# Altium project Cleanroom PSM.PrjPcb
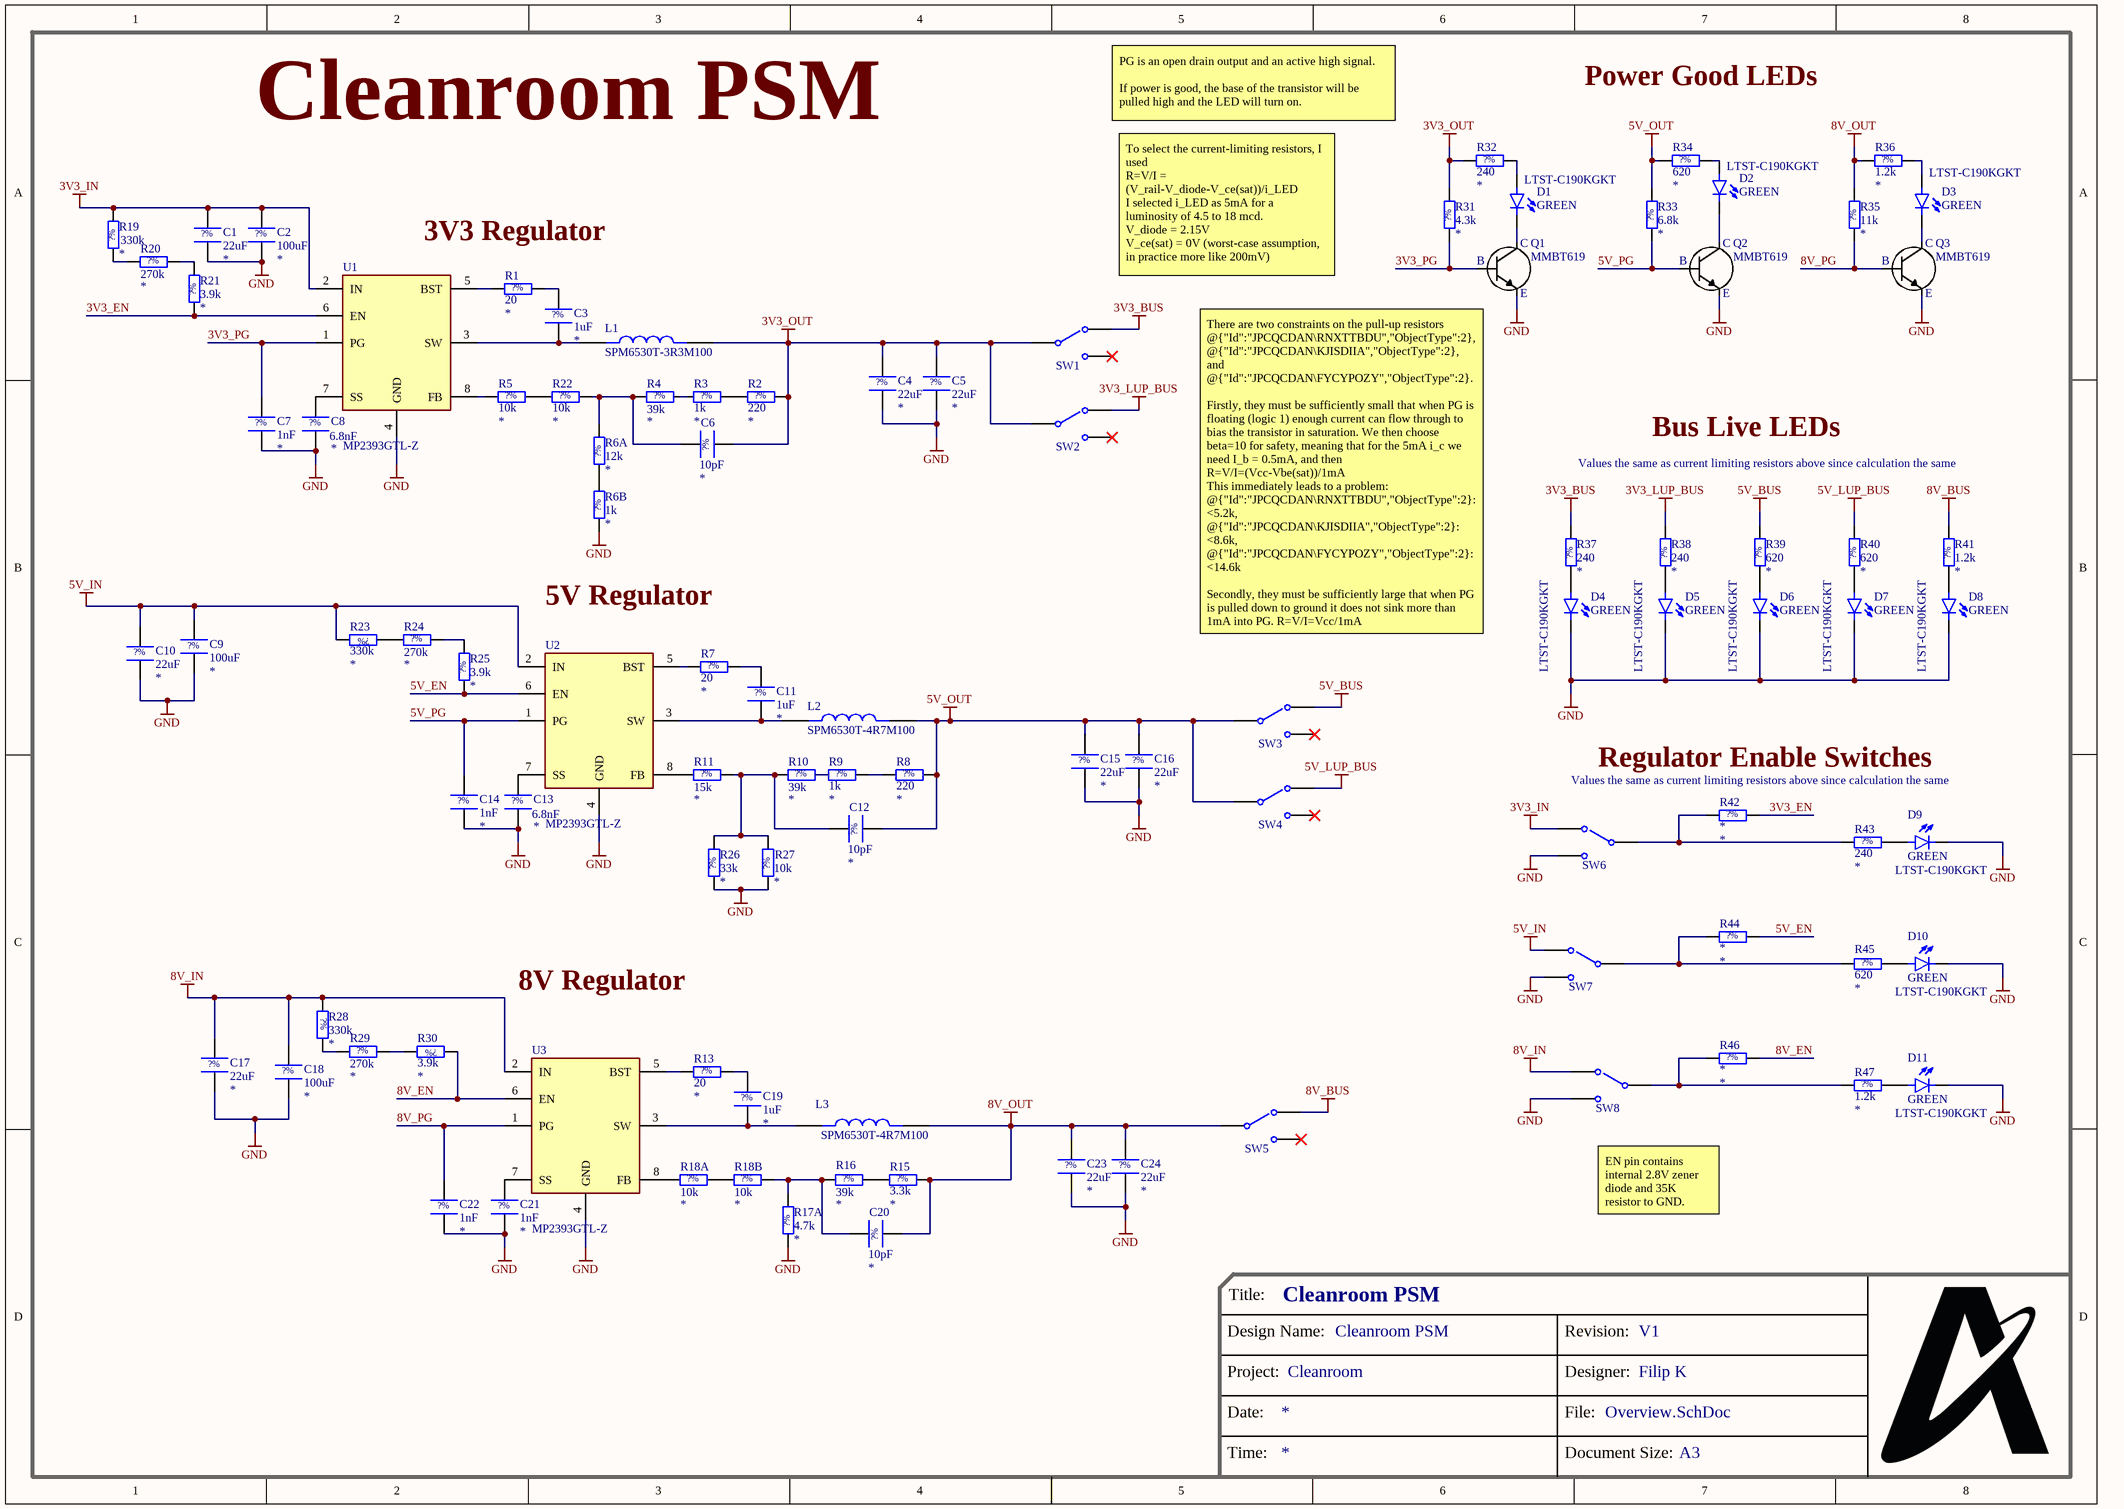
[diagram p0: Overview.SchDoc]
BoardRevision: V1; Designer: Filip K; DesignName: Cleanroom PSM; Project: Cleanroom
1 sheet, 99 parts. Net scope: global (net labels, ports and power ports of the same name join across sheets).
Board file: Overview.PcbDoc

## Sheet Overview.SchDoc: Cleanroom PSM
size A3; PageSetup: Record=PageOptions|CenterHorizontal=True|CenterVertical=True|PrintScale=0.97|XCorrection=1.00|YCorrection=1.00|PrintKind=0|BorderSize=5000000|LeftOffset=0|BottomOffset=0|Orientation=2|PaperLength=1000|PaperWidth=1000|Scale=100|PaperSource=7|PrintQuality=-4|MediaType=1|DitherType=10|PaperKind=A4|PrintScaleMode=1; SheetNumber: 1; SheetTotal: 1

### Parts
C1  22uF  [CAPACITOR_0805_2012M-70N]
C2  100uF  [CAPACITOR_0805_2012M-70N]
C3  1uF  [CAPACITOR_0805_2012M-70N]
C4  22uF  [CAPACITOR_0805_2012M-70N]
C5  22uF  [CAPACITOR_0805_2012M-70N]
C6  10pF  [CAPACITOR_0805_2012M-70N]
C7  1nF  [CAPACITOR_0805_2012M-70N]
C8  6.8nF  [CAPACITOR_0805_2012M-70N]
C9  100uF  [CAPACITOR_0805_2012M-70N]
C10  22uF  [CAPACITOR_0805_2012M-70N]
C11  1uF  [CAPACITOR_0805_2012M-70N]
C12  10pF  [CAPACITOR_0805_2012M-70N]
C13  6.8nF  [CAPACITOR_0805_2012M-70N]
C14  1nF  [CAPACITOR_0805_2012M-70N]
C15  22uF  [CAPACITOR_0805_2012M-70N]
C16  22uF  [CAPACITOR_0805_2012M-70N]
C17  22uF  [CAPACITOR_0805_2012M-70N]
C18  100uF  [CAPACITOR_0805_2012M-70N]
C19  1uF  [CAPACITOR_0805_2012M-70N]
C20  10pF  [CAPACITOR_0805_2012M-70N]
C21  1nF  [CAPACITOR_0805_2012M-70N]
C22  1nF  [CAPACITOR_0805_2012M-70N]
C23  22uF  [CAPACITOR_0805_2012M-70N]
C24  22uF  [CAPACITOR_0805_2012M-70N]
D1  MF Part No.: LTST-C190KGKT  Colour: GREEN  [LED_0603_1608M_0.80mm]  (hidden comment: LTST-C190 Series)
D2  MF Part No.: LTST-C190KGKT  Colour: GREEN  [LED_0603_1608M_0.80mm]  (hidden comment: LTST-C190 Series)
D3  MF Part No.: LTST-C190KGKT  Colour: GREEN  [LED_0603_1608M_0.80mm]  (hidden comment: LTST-C190 Series)
D4  MF Part No.: LTST-C190KGKT  Colour: GREEN  [LED_0603_1608M_0.80mm]  (hidden comment: LTST-C190 Series)
D5  MF Part No.: LTST-C190KGKT  Colour: GREEN  [LED_0603_1608M_0.80mm]  (hidden comment: LTST-C190 Series)
D6  MF Part No.: LTST-C190KGKT  Colour: GREEN  [LED_0603_1608M_0.80mm]  (hidden comment: LTST-C190 Series)
D7  MF Part No.: LTST-C190KGKT  Colour: GREEN  [LED_0603_1608M_0.80mm]  (hidden comment: LTST-C190 Series)
D8  MF Part No.: LTST-C190KGKT  Colour: GREEN  [LED_0603_1608M_0.80mm]  (hidden comment: LTST-C190 Series)
D9  MF Part No.: LTST-C190KGKT  Colour: GREEN  [LED_0603_1608M_0.80mm]  (hidden comment: LTST-C190 Series)
D10  MF Part No.: LTST-C190KGKT  Colour: GREEN  [LED_0603_1608M_0.80mm]  (hidden comment: LTST-C190 Series)
D11  MF Part No.: LTST-C190KGKT  Colour: GREEN  [LED_0603_1608M_0.80mm]  (hidden comment: LTST-C190 Series)
L1  SPM6530T-3R3M100  [IND_SPM6530T-1R5M100]
L2  SPM6530T-4R7M100  [IND_SPM6530T-1R5M100]
L3  SPM6530T-4R7M100  [IND_SPM6530T-1R5M100]
Q1  MMBT619  [SOT23-3N-1.15mm]
Q2  MMBT619  [SOT23-3N-1.15mm]
Q3  MMBT619  [SOT23-3N-1.15mm]
R1  20  [RESISTOR_0805_2012M-50N]
R2  220  [RESISTOR_0805_2012M-50N]
R3  1k  [RESISTOR_0805_2012M-50N]
R4  39k  [RESISTOR_0805_2012M-50N]
R5  10k  [RESISTOR_0805_2012M-50N]
R6A  12k  [RESISTOR_0805_2012M-50N]
R6B  1k  [RESISTOR_0805_2012M-50N]
R7  20  [RESISTOR_0805_2012M-50N]
R8  220  [RESISTOR_0805_2012M-50N]
R9  1k  [RESISTOR_0805_2012M-50N]
R10  39k  [RESISTOR_0805_2012M-50N]
R11  15k  [RESISTOR_0805_2012M-50N]
R13  20  [RESISTOR_0805_2012M-50N]
R15  3.3k  [RESISTOR_0805_2012M-50N]
R16  39k  [RESISTOR_0805_2012M-50N]
R17A  4.7k  [RESISTOR_0805_2012M-50N]
R18A  10k  [RESISTOR_0805_2012M-50N]
R18B  10k  [RESISTOR_0805_2012M-50N]
R19  330k  [RESISTOR_0805_2012M-50N]
R20  270k  [RESISTOR_0805_2012M-50N]
R21  3.9k  [RESISTOR_0805_2012M-50N]
R22  10k  [RESISTOR_0805_2012M-50N]
R23  330k  [RESISTOR_0805_2012M-50N]
R24  270k  [RESISTOR_0805_2012M-50N]
R25  3.9k  [RESISTOR_0805_2012M-50N]
R26  33k  [RESISTOR_0805_2012M-50N]
R27  10k  [RESISTOR_0805_2012M-50N]
R28  330k  [RESISTOR_0805_2012M-50N]
R29  270k  [RESISTOR_0805_2012M-50N]
R30  3.9k  [RESISTOR_0805_2012M-50N]
R31  4.3k  [RESISTOR_0805_2012M-50N]
R32  240  [RESISTOR_0805_2012M-50N]
R33  6.8k  [RESISTOR_0805_2012M-50N]
R34  620  [RESISTOR_0805_2012M-50N]
R35  11k  [RESISTOR_0805_2012M-50N]
R36  1.2k  [RESISTOR_0805_2012M-50N]
R37  240  [RESISTOR_0805_2012M-50N]
R38  240  [RESISTOR_0805_2012M-50N]
R39  620  [RESISTOR_0805_2012M-50N]
R40  620  [RESISTOR_0805_2012M-50N]
R41  1.2k  [RESISTOR_0805_2012M-50N]
R42  *  [RESISTOR_0805_2012M-50N]
R43  240  [RESISTOR_0805_2012M-50N]
R44  *  [RESISTOR_0805_2012M-50N]
R45  620  [RESISTOR_0805_2012M-50N]
R46  *  [RESISTOR_0805_2012M-50N]
R47  1.2k  [RESISTOR_0805_2012M-50N]
SW1  ANT11SF1CQE  [ANT11SF1CQE]  (value not drawn)
SW2  ANT11SF1CQE  [ANT11SF1CQE]  (value not drawn)
SW3  ANT11SF1CQE  [ANT11SF1CQE]  (value not drawn)
SW4  ANT11SF1CQE  [ANT11SF1CQE]  (value not drawn)
SW5  ANT11SF1CQE  [ANT11SF1CQE]  (value not drawn)
SW6  ANT11SF1CQE  [ANT11SF1CQE]  (value not drawn)
SW7  ANT11SF1CQE  [ANT11SF1CQE]  (value not drawn)
SW8  ANT11SF1CQE  [ANT11SF1CQE]  (value not drawn)
U1  MP2393GTL-Z  [SOT-583-2.1mmx1.6mmBody-0.6mm]
U2  MP2393GTL-Z  [SOT-583-2.1mmx1.6mmBody-0.6mm]
U3  MP2393GTL-Z  [SOT-583-2.1mmx1.6mmBody-0.6mm]

### Nets
3V3_BUS: R37.2 SW1.1
3V3_IN: C1.2 C2.2 R19.2 SW6.1 U1.2(IN)
3V3_LUP_BUS: R38.2 SW2.1
3V3_OUT: C4.2 C5.2 C6.1 L1.2 R2.2 R31.2 R32.1 SW1.2 SW2.2
5V_BUS: R39.2 SW3.1
5V_IN: C9.2 C10.2 R23.2 SW7.1 U2.2(IN)
5V_LUP_BUS: R40.2 SW4.1
5V_OUT: C12.1 C15.2 C16.2 L2.2 R8.2 R33.2 R34.1 SW3.2 SW4.2
8V_BUS: R41.2 SW5.1
8V_IN: C17.2 C18.2 R28.1 SW8.1 U3.2(IN)
8V_OUT: C20.1 C23.2 C24.2 L3.2 R15.2 R35.2 R36.1 SW5.2
GND: C1.1 C2.1 C4.1 C5.1 C7.1 C8.1 C9.1 C10.1 C13.1 C14.1 C15.1 C16.1 C17.1 C18.1 C21.1 C22.1 C23.1 C24.1 D4.C D5.C D6.C D7.C D8.C D9.C D10.C D11.C Q1.2(E) Q2.2(E) Q3.2(E) R6B.1 R17A.1 R26.1 R27.1 SW6.3 SW7.3 SW8.3 U1.4(GND) U2.4(GND) U3.4(GND)
3V3_EN: R21.1 R42.2 U1.6(EN)
3V3_PG: C7.2 Q1.1(B) R31.1 U1.1(PG)
5V_EN: R25.1 R44.2 U2.6(EN)
5V_PG: C14.2 Q2.1(B) R33.1 U2.1(PG)
8V_EN: R30.1 R46.2 U3.6(EN)
8V_PG: C22.2 Q3.1(B) R35.1 U3.1(PG)
NetC3_1: C3.1 L1.1 U1.3(SW)
NetC3_2: C3.2 R1.2
NetC6_2: C6.2 R4.1 R6A.2 R22.2
NetC8_2: C8.2 U1.7(SS)
NetC11_1: C11.1 L2.1 U2.3(SW)
NetC11_2: C11.2 R7.2
NetC12_2: C12.2 R10.1 R11.2 R26.2 R27.2
NetC13_2: C13.2 U2.7(SS)
NetC19_1: C19.1 L3.1 U3.3(SW)
NetC19_2: C19.2 R13.2
NetC20_2: C20.2 R16.1 R17A.2 R18B.2
NetC21_2: C21.2 U3.7(SS)
NetD1_A: D1.A R32.2
NetD1_C: D1.C Q1.3(C)
NetD2_A: D2.A R34.2
NetD2_C: D2.C Q2.3(C)
NetD3_A: D3.A R36.2
NetD3_C: D3.C Q3.3(C)
NetD4_A: D4.A R37.1
NetD5_A: D5.A R38.1
NetD6_A: D6.A R39.1
NetD7_A: D7.A R40.1
NetD8_A: D8.A R41.1
NetD9_A: D9.A R43.2
NetD10_A: D10.A R45.2
NetD11_A: D11.A R47.2
NetR1_1: R1.1 U1.5(BST)
NetR2_1: R2.1 R3.2
NetR3_1: R3.1 R4.2
NetR5_1: R5.1 U1.8(FB)
NetR5_2: R5.2 R22.1
NetR6A_1: R6A.1 R6B.2
NetR7_1: R7.1 U2.5(BST)
NetR8_1: R8.1 R9.2
NetR9_1: R9.1 R10.2
NetR11_1: R11.1 U2.8(FB)
NetR13_1: R13.1 U3.5(BST)
NetR15_1: R15.1 R16.2
NetR18A_1: R18A.1 U3.8(FB)
NetR18A_2: R18A.2 R18B.1
NetR19_1: R19.1 R20.1
NetR20_2: R20.2 R21.2
NetR23_1: R23.1 R24.1
NetR24_2: R24.2 R25.2
NetR28_2: R28.2 R29.1
NetR29_2: R29.2 R30.2
NetR42_1: R42.1 R43.1 SW6.2
NetR44_1: R44.1 R45.1 SW7.2
NetR46_1: R46.1 R47.1 SW8.2

Not connected (* = marked no-connect by the designer): SW1 3*; SW2 3*; SW3 3*; SW4 3*; SW5 3*

### Notes on the sheet
- Power Good LEDs
- Cleanroom PSM
- PG is an open drain output and an active high signal.
  If power is good, the base of the transistor will be pulled high and the LED will turn on.
- 3V3 Regulator
- To select the current-limiting resistors, I used
  R=V/I = (V_rail-V_diode-V_ce(sat))/i_LED
  I selected i_LED as 5mA for a luminosity of 4.5 to 18 mcd.
  V_diode = 2.15V
  V_ce(sat) = 0V (worst-case assumption, in practice more like 200mV)
- Bus Live LEDs
- Values the same as current limiting resistors above since calculation the same
- 5V Regulator
- (near Q1) There are two constraints on the pull-up resistors @{"Id":"JPCQCDAN\RNXTTBDU","ObjectType":2}, @{"Id":"JPCQCDAN\KJISDIIA","ObjectType":2}, and @{"Id":"JPCQCDAN\FYCYPOZY","ObjectType":2}.
  Firstly, they must be sufficiently small that when PG is floating (logic 1) enough current can flow through to bias the transistor in saturation. We then choose beta=10 for safety, meaning that for the 5mA i_c we need I_b = 0.5mA, and then R=V/I=(Vcc-Vbe(sat))/1mA
  This immediately leads to a problem:
  @{"Id":"JPCQCDAN\RNXTTBDU","ObjectType":2}: <5.2k, @{"Id":"JPCQCDAN\KJISDIIA","ObjectType":2}: <8.6k, @{"Id":"JPCQCDAN\FYCYPOZY","ObjectType":2}: <14.6k
  Secondly, they must be sufficiently large that when PG is pulled down to ground it does not sink more than 1mA into PG. R=V/I=Vcc/1mA
  @{"Id":"JPCQCDAN\RNXTTBDU","ObjectType":2}: >3.3k, @{"Id":"JPCQCDAN\KJISDIIA","ObjectType":2}: >5k, @{"Id":"JPCQCDAN\FYCYPOZY","ObjectType":2}: >8k
  Taking the mean of each of these ranges and rounding to the nearest E24,
  @{"Id":"JPCQCDAN\RNXTTBDU","ObjectType":2}: 4.3k, @{"Id":"JPCQCDAN\KJISDIIA","ObjectType":2}: 6.8k, @{"Id":"JPCQCDAN\FYCYPOZY","ObjectType":2}: 11k
- Regulator Enable Switches
- 8V Regulator
- (near SW8) EN pin contains internal 2.8V zener diode and 35K resistor to GND.
- Title:
- Design Name:
- Project:
- Revision:
- Designer:
- Date:
- Time:
- File:
- Document Size:
- A3

### Library data of the parts
C1-C24 = Generic Capacitor: Passive - Capacitor, Generic; Tolerance: ?%; MF Part No.: *
  C1 C4 C5 C10 C15-C17 C23 C24: Value: 22uF
  C2 C9 C18: Value: 100uF
  C3 C11 C19: Value: 1uF
  C6 C12 C20: Value: 10pF
  C7 C14 C21 C22: Value: 1nF
  C8 C13: Value: 6.8nF
D1-D11 = LTST-C190 Series: Diode - LED, 0603; APSS Standard Part: APSS Standard; Temp Range: -30°C ~ 85°C; Rated Voltage: 5V Reverse; Package: 0603; Supplier 1: Digikey
L1-L3 = SPM6530T-1R5M100: 1.5 ÂµH Shielded Drum Core, Wirewound Inductor 11 A 10.67mOhm Max Nonstandard; MF: TDK; Value: *; Digi-Key_Part_Number: 445-3881-2-ND; Check_prices: https://www.snapeda.com/parts/SPM6530T-1R5M100/TDK/view-part/?ref=eda; Package: NON STANDARD-2 TDK; SnapEDA_Link: https://www.snapeda.com/parts/SPM6530T-1R5M100/TDK/view-part/?ref=snap; MP: SPM6530T-1R5M100; Purchase-URL: https://pricing.snapeda.com/search/part/SPM6530T-1R5M100/?ref=eda
Q1-Q3 = MMBT619: Transistor - BJT NPN MMBT619; APSS Standard Part: APSS Standard; Temp Range: -55°C ~ 150°C (TJ); Rated Voltage: 50 Vce; Power: 350mW; MF Part No.: MMBT619; Package: SOT-23-3; Supplier 1: Digikey; Supplier 1 Part No.: 4786-MMBT619CT-ND
R1-R5 R6A R6B R7-R11 R13 R15 R16 R17A R18A R18B R19-R47 = Generic Resistor: Passive - Resistor, Generic; Tolerance: ?%; MF Part No.: *
  R1 R7 R13: Value: 20
  R2 R8: Value: 220
  R3 R6B R9: Value: 1k
  R4 R10 R16: Value: 39k
  R5 R18A R18B R22 R27: Value: 10k
  R6A: Value: 12k
  R11: Value: 15k
  R15: Value: 3.3k
  R17A: Value: 4.7k
  R19 R23 R28: Value: 330k
  R20 R24 R29: Value: 270k
  R21 R25 R30: Value: 3.9k
  R26: Value: 33k
  R31: Value: 4.3k
  R32 R37 R38 R43: Value: 240
  R33: Value: 6.8k
  R34 R39 R40 R45: Value: 620
  R35: Value: 11k
  R36 R41 R47: Value: 1.2k
  R42 R44 R46: Value: *
SW1-SW8 = ANT11SF1CQE: Switch - Toggle, SPDT, 5A @ 28VDC; Temp Range: -40°C ~ 85°C (TA); MF Part No.: ANT11SF1CQE; Package: -; Supplier 1: Digikey; Supplier 1 Part No.: 2449-ANT11SF1CQE-ND; Rated Current: 5A; Rated Voltage: 28 VDC; Circuit: SPDT
U1-U3 = MP2393GTL-Z: IC - Regulator, Switching, 3A, 4.2V to 24V In, 0.8V to 13V Out, SOT-583; Temp Range: -40°C ~ 125°C (TA); MF Part No.: MP2393GTL-Z; Package: SOT-583; Supplier 1: Digikey; Supplier 1 Part No.: 1589-MP2393GTL-ZCT-ND; Rated Voltage: 24V